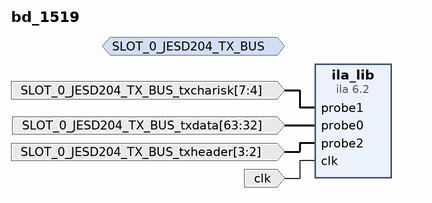
[diagram p0: block diagram of the top level]
# Vivado block design bd_1519, xc7z045ffg900-2, Vivado 2022.2
create_bd_design bd_1519

create_bd_intf_port -mode Monitor -vlnv xilinx.com:display_jesd204:jesd204_tx_bus_rtl:1.0 SLOT_0_JESD204_TX_BUS
create_bd_port -dir I -type clk clk
create_bd_port -dir I -from 63 -to 32 SLOT_0_JESD204_TX_BUS_txdata
create_bd_port -dir I -from 7 -to 4 SLOT_0_JESD204_TX_BUS_txcharisk
create_bd_port -dir I -from 3 -to 2 SLOT_0_JESD204_TX_BUS_txheader

create_bd_cell -type ip -vlnv xilinx.com:ip:ila:6.2 ila_lib
set_property -dict [list \
  CONFIG.ALL_PROBE_SAME_MU TRUE \
  CONFIG.ALL_PROBE_SAME_MU_CNT 1 \
  CONFIG.C_ADV_TRIGGER FALSE \
  CONFIG.C_DATA_DEPTH 1024 \
  CONFIG.C_EN_STRG_QUAL 0 \
  CONFIG.C_EN_TIME_TAG 0 \
  CONFIG.C_ILA_CLK_FREQ 100000000 \
  CONFIG.C_INPUT_PIPE_STAGES 0 \
  CONFIG.C_MONITOR_TYPE Native \
  CONFIG.C_NUM_OF_PROBES 3 \
  CONFIG.C_PROBE0_TYPE 0 \
  CONFIG.C_PROBE0_WIDTH 32 \
  CONFIG.C_PROBE1_TYPE 0 \
  CONFIG.C_PROBE1_WIDTH 4 \
  CONFIG.C_PROBE2_TYPE 0 \
  CONFIG.C_PROBE2_WIDTH 2 \
  CONFIG.C_TIME_TAG_WIDTH 32 \
  CONFIG.C_TRIGIN_EN false \
  CONFIG.C_TRIGOUT_EN false \
  CONFIG.C_XLNX_HW_PROBE_INFO DEFAULT \
] [get_bd_cells ila_lib]

# ---- connections ----

connect_bd_net [get_bd_ports SLOT_0_JESD204_TX_BUS_txcharisk] [get_bd_pins ila_lib/probe1]
connect_bd_net [get_bd_ports SLOT_0_JESD204_TX_BUS_txdata] [get_bd_pins ila_lib/probe0]
connect_bd_net [get_bd_ports SLOT_0_JESD204_TX_BUS_txheader] [get_bd_pins ila_lib/probe2]
connect_bd_net [get_bd_ports clk] [get_bd_pins ila_lib/clk]

validate_bd_design
save_bd_design
